# Altium schematic sheet 01_MAIN.SchDoc: =GlobalProjectName
size 594 x 420 mm; CheckedBy: A_D; Author: A_D; SheetNumber: 1; SheetTotal: 3; PageSetup: Record=PageOptions|CenterHorizontal=True|CenterVertical=True|PrintScale=0.70|XCorrection=1.00|YCorrection=1.00|PrintKind=2|BorderSize=5000000|LeftOffset=9000|BottomOffset=10100|Orientation=2|PaperLength=11176|PaperWidth=8636|Scale=100|PaperSource=259|PrintQuality=-3|MediaType=1|DitherType=10|PrintScaleMode=1|PaperKind=A3|PaperIndex=8
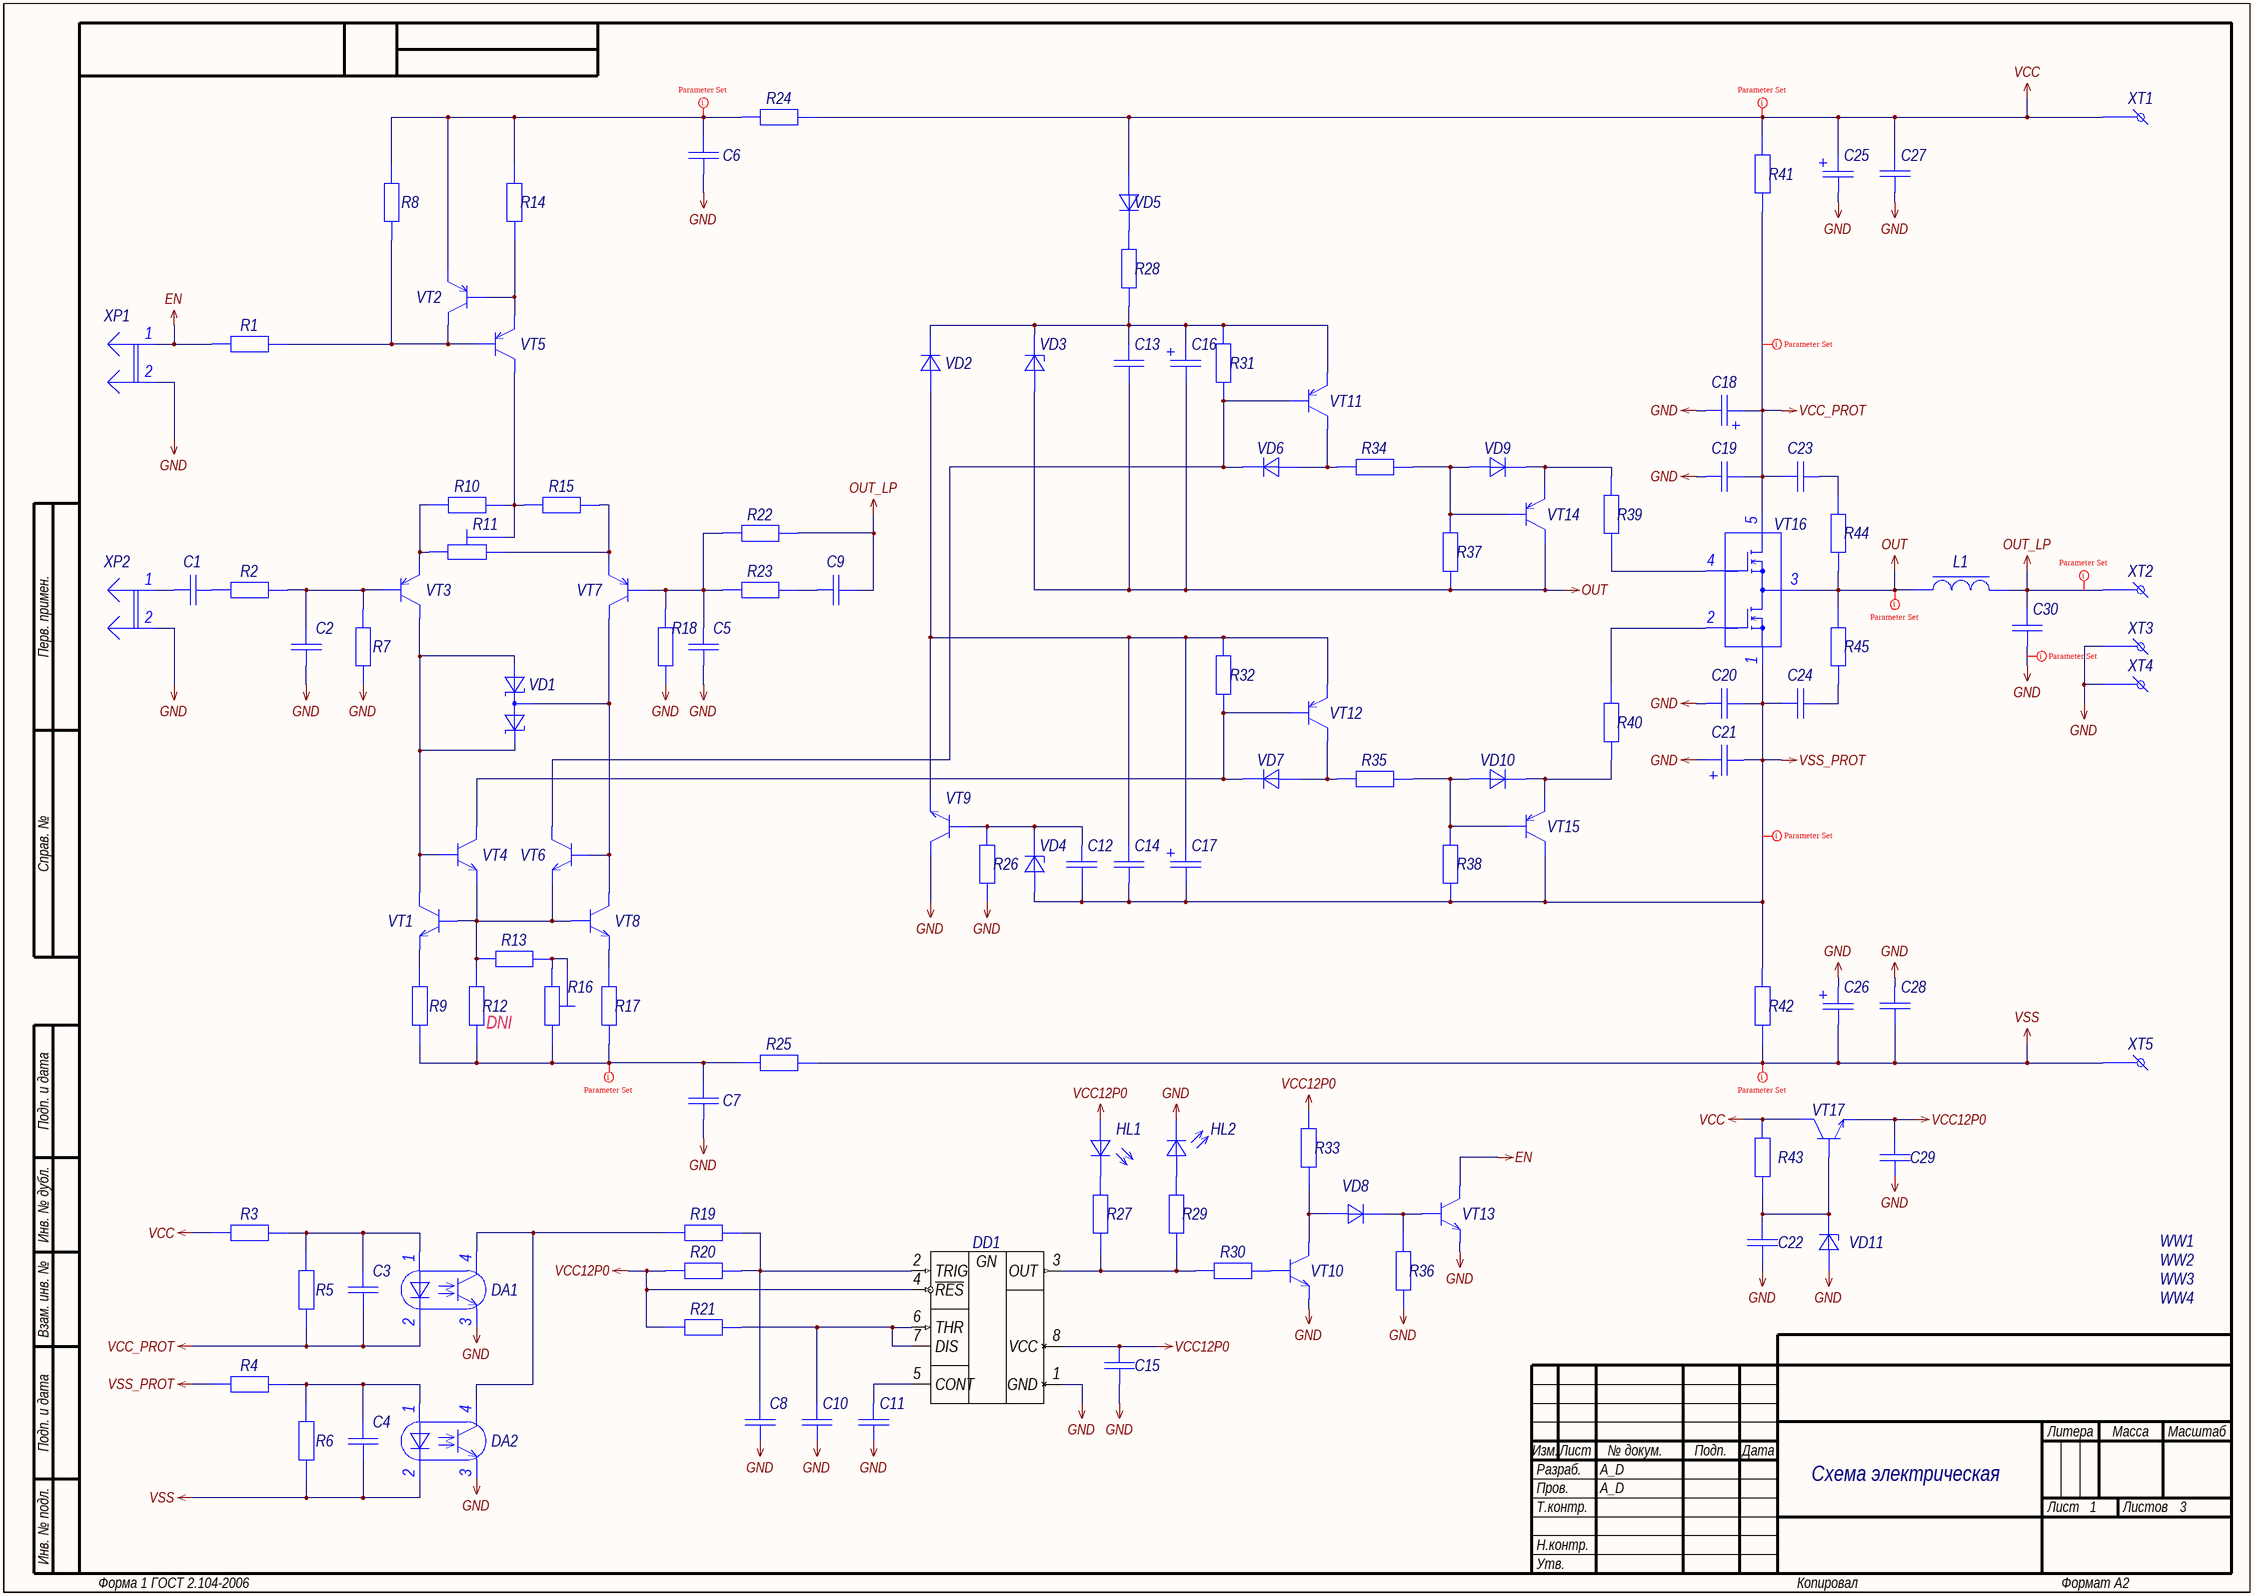
[diagram p0: 01_MAIN.SchDoc]

## Parts
C1  Capacitor  [CAPF_050D500P720X500X1000]  (value not drawn)
C2  Capacitor  [CAPF_050D500P720X450X600]  (value not drawn)
C3  Capacitor  [C0603_L]  (value not drawn)
C4  Capacitor  [C0603_L]  (value not drawn)
C5  Capacitor  [C0603_L]  (value not drawn)
C6  Capacitor  [C0805_L]  (value not drawn)
C7  Capacitor  [C0805_L]  (value not drawn)
C8  Capacitor  [C0603_L]  (value not drawn)
C9  Capacitor  [C0603_L]  (value not drawn)
C10  Capacitor  [C0603_L]  (value not drawn)
C11  Capacitor  [C0603_L]  (value not drawn)
C12  Capacitor  [C0603_L]  (value not drawn)
C13  Capacitor  [C0805_L]  (value not drawn)
C14  Capacitor  [C0805_L]  (value not drawn)
C15  Capacitor  [C0603_L]  (value not drawn)
C16  Capacitor-E  [CAPE_040D250P630X1100]  (value not drawn)
C17  Capacitor-E  [CAPE_040D250P630X1100]  (value not drawn)
C18  Capacitor-E  [CAPE_040D200P500X1100]  (value not drawn)
C19  Capacitor  [C0805_L]  (value not drawn)
C20  Capacitor  [C0805_L]  (value not drawn)
C21  Capacitor-E  [CAPE_040D200P500X1100]  (value not drawn)
C22  Capacitor  [C0603_L]  (value not drawn)
C23  Capacitor  [C0603_L]  (value not drawn)
C24  Capacitor  [C0603_L]  (value not drawn)
C25  Capacitor-E  [CAPE_060D500P1000X2000]  (value not drawn)
C26  Capacitor-E  [CAPE_060D500P1000X2000]  (value not drawn)
C27  Capacitor  [C0805_L]  (value not drawn)
C28  Capacitor  [C0805_L]  (value not drawn)
C29  Capacitor  [C0805_L]  (value not drawn)
C30  Capacitor  [CAPF_080D1500P1800X600X1250]  (value not drawn)
DA1  Photocoupler-4p  [SOP-4_254P430X440X200_N]  (value not drawn)
DA2  Photocoupler-4p  [SOP-4_254P430X440X200_N]  (value not drawn)
DD1  TIM-555  [SOIC-8_127P490X391X155_N]  (value not drawn)
HL1  ON  [LD0603]  (value not drawn)
HL2  PROT  [LD0603]  (value not drawn)
L1  Coil  [B82477G4-Series]  (value not drawn)
R1  Resistor  [R0603_L]  (value not drawn)
R2  Resistor  [R0603_L]  (value not drawn)
R3  Resistor  [R0603_L]  (value not drawn)
R4  Resistor  [R0603_L]  (value not drawn)
R5  Resistor  [R0603_L]  (value not drawn)
R6  Resistor  [R0603_L]  (value not drawn)
R7  Resistor  [R0603_L]  (value not drawn)
R8  Resistor  [R0603_L]  (value not drawn)
R9  Resistor  [R0603_L]  (value not drawn)
R10  Resistor  [R0603_L]  (value not drawn)
R11  Resistor-Trimmer-1  [3266W]  (value not drawn)
R12  Resistor  [R0603_L]  (value not drawn)  (no BOM)
R13  Resistor  [R0603_L]  (value not drawn)
R14  Resistor  [R0603_L]  (value not drawn)
R15  Resistor  [R0603_L]  (value not drawn)
R16  Resistor-Trimmer-1  [3266W]  (value not drawn)
R17  Resistor  [R0603_L]  (value not drawn)
R18  Resistor  [R0603_L]  (value not drawn)
R19  Resistor  [R0603_L]  (value not drawn)
R20  Resistor  [R0603_L]  (value not drawn)
R21  Resistor  [R0603_L]  (value not drawn)
R22  Resistor  [R0603_L]  (value not drawn)
R23  Resistor  [R0603_L]  (value not drawn)
R24  Resistor  [R0805_L]  (value not drawn)
R25  Resistor  [R0805_L]  (value not drawn)
R26  Resistor  [R0603_L]  (value not drawn)
R27  Resistor  [R0603_L]  (value not drawn)
R28  Resistor  [R0603_L]  (value not drawn)
R29  Resistor  [R0603_L]  (value not drawn)
R30  Resistor  [R0603_L]  (value not drawn)
R31  Resistor  [R0603_L]  (value not drawn)
R32  Resistor  [R0603_L]  (value not drawn)
R33  Resistor  [R0603_L]  (value not drawn)
R34  Resistor  [R0603_L]  (value not drawn)
R35  Resistor  [R0603_L]  (value not drawn)
R36  Resistor  [R0603_L]  (value not drawn)
R37  Resistor  [R0603_L]  (value not drawn)
R38  Resistor  [R0603_L]  (value not drawn)
R39  Resistor  [R0603_L]  (value not drawn)
R40  Resistor  [R0603_L]  (value not drawn)
R41  Resistor  [R2512_L]  (value not drawn)
R42  Resistor  [R2512_L]  (value not drawn)
R43  Resistor  [R0603_L]  (value not drawn)
R44  Resistor  [R0805_L]  (value not drawn)
R45  Resistor  [R0805_L]  (value not drawn)
VD1  Schottky_AC  [SOT-23_190P290X160X145_N]  (value not drawn)
VD2  Diode  [SOD-323]  (value not drawn)
VD3  Zener  [SOD-323]  (value not drawn)
VD4  Zener  [SOD-323]  (value not drawn)
VD5  Diode  [SOD-323]  (value not drawn)
VD6  Diode  [SOD-323]  (value not drawn)
VD7  Diode  [SOD-323]  (value not drawn)
VD8  Diode  [SOD-323]  (value not drawn)
VD9  Diode  [SOD-323]  (value not drawn)
VD10  Diode  [SOD-323]  (value not drawn)
VD11  Zener  [SOD-323]  (value not drawn)
VT1  BJT-NPN  [SOT-23_190P290X160X145_N]  (value not drawn)
VT2  BJT-PNP  [SOT-23_190P290X160X145_N]  (value not drawn)
VT3  BJT-PNP  [SOT-23_190P290X160X145_N]  (value not drawn)
VT4  BJT-NPN  [SOT-23_190P290X160X145_N]  (value not drawn)
VT5  BJT-PNP  [SOT-89_150P460X260X170_N]  (value not drawn)
VT6  BJT-NPN  [SOT-23_190P290X160X145_N]  (value not drawn)
VT7  BJT-PNP  [SOT-23_190P290X160X145_N]  (value not drawn)
VT8  BJT-NPN  [SOT-23_190P290X160X145_N]  (value not drawn)
VT9  BJT-NPN  [SOT-89_150P460X260X170_N]  (value not drawn)
VT10  BJT-NPN  [SOT-23_190P290X160X145_N]  (value not drawn)
VT11  BJT-PNP  [SOT-23_190P290X160X145_N]  (value not drawn)
VT12  BJT-PNP  [SOT-23_190P290X160X145_N]  (value not drawn)
VT13  BJT-NPN  [SOT-23_190P290X160X145_N]  (value not drawn)
VT14  BJT-PNP  [SOT-23_190P290X160X145_N]  (value not drawn)
VT15  BJT-PNP  [SOT-23_190P290X160X145_N]  (value not drawn)
VT16  IRFI4212H-117P  [TO-220-5-117-WB]  (value not drawn)
VT17  BJT-NPN  [SOT-89_150P460X260X170_N]  (value not drawn)
WW1  NoBody  [MH_M3.0]  (value not drawn)  (no BOM)
WW2  NoBody  [MH_M3.0]  (value not drawn)  (no BOM)
WW3  NoBody  [MH_M3.0]  (value not drawn)  (no BOM)
WW4  NoBody  [MH_M3.0]  (value not drawn)  (no BOM)
XP1  EN  [PLS-2]  (value not drawn)
XP2  IN  [PLS-2]  (value not drawn)
XT1  VCC  [62650-1]  (value not drawn)
XT2  OUT  [62650-1]  (value not drawn)
XT3  GND  [62650-1]  (value not drawn)
XT4  GND  [62650-1]  (value not drawn)
XT5  VSS  [62650-1]  (value not drawn)

## Nets
EN: R1.2 VT13.2(К) XP1.1
GND: C2.1 C5.1 C6.1 C7.1 C8.1 C10.1 C11.1 C15.1 C18.2 C19.2 C20.2 C21.1 C22.1 C25.2 C26.1 C27.2 C28.1 C29.1 C30.1 DA1.3(Э) DA2.3(Э) DD1.1(GND) HL2.2(К) R7.1 R18.1 R26.1 R36.1 VD11.1(А) VT9.2(К) VT10.3(Э) VT13.3(Э) XP1.2 XP2.2 XT3.1 XT4.1
OUT: C13.1 C16.2 L1.1 R37.1 R44.1 R45.2 VD3.1(А) VT14.2(К) VT16.3(S1D2)
OUT_LP: C9.2 C30.2 L1.2 R22.2 XT2.1
VCC: C25.1 C27.1 R3.1 R24.2 R41.2 R43.2 VD5.1(А) VT17.2(К) XT1.1
VCC12P0: C15.2 C29.2 DD1.4(~{RES}) DD1.8(VCC) HL1.1(А) R20.1 R21.1 R33.2 VT17.3(Э)
VCC_PROT: C3.1 C18.1 C19.1 C23.1 DA1.2(CК) R5.1 R41.1 VT16.5(D1)
VSS: C4.1 C26.2 C28.2 DA2.2(CК) R6.1 R25.2 R42.1 XT5.1
VSS_PROT: C12.1 C14.1 C17.2 C20.1 C21.2 C24.1 R4.1 R38.1 R42.2 VD4.1(А) VT15.2(К) VT16.1(S2)
NetC1_1: C1.1 XP2.1
NetC1_2: C1.2 R2.1
NetC2_2: C2.2 R2.2 R7.2 VT3.1(Б)
NetC3_2: C3.2 DA1.1(CА) R3.2 R5.2
NetC4_2: C4.2 DA2.1(CА) R4.2 R6.2
NetC5_2: C5.2 R18.2 R22.1 R23.1 VT7.1(Б)
NetC6_2: C6.2 R8.2 R14.2 R24.1 VT2.3(Э)
NetC7_2: C7.2 R9.1 R12.1 R16.3 R17.1 R25.1
NetC8_2: C8.2 DD1.2(TRIG) R19.2 R20.2
NetC9_1: C9.1 R23.2
NetC10_2: C10.2 DD1.6(THR) DD1.7(DIS) R21.2
NetC11_2: C11.2 DD1.5(CONT)
NetC12_2: C12.2 R26.2 VD4.2(К) VT9.1(Б)
NetC13_2: C13.2 C16.1 R28.1 R31.2 VD2.2(К) VD3.2(К) VT11.3(Э)
NetC14_2: C14.2 C17.1 R32.2 VD2.1(А) VT9.3(Э) VT12.3(Э)
NetC22_2: C22.2 R43.1 VD11.2(К) VT17.1(Б)
NetC23_2: C23.2 R44.2
NetC24_2: C24.2 R45.1
NetDA1_4: DA1.4(К) DA2.4(К) R19.1
NetDD1_3: DD1.3(OUT) R27.1 R29.1 R30.1
NetHL1_2: HL1.2(К) R27.2
NetHL2_1: HL2.1(А) R29.2
NetR1_1: R1.1 R8.1 VT2.2(К) VT5.1(Б)
NetR9_2: R9.2 VT1.3(Э)
NetR10_1: R10.1 R11.3 VT3.3(Э)
NetR10_2: R10.2 R11.2 R15.1 VT5.2(К)
NetR11_1: R11.1 R15.2 VT7.3(Э)
NetR12_2: R12.2 R13.1 VT1.1(Б) VT4.3(Э) VT6.3(Э) VT8.1(Б)
NetR13_2: R13.2 R16.1 R16.2
NetR14_1: R14.1 VT2.1(Б) VT5.3(Э)
NetR17_2: R17.2 VT8.3(Э)
NetR28_2: R28.2 VD5.2(К)
NetR30_2: R30.2 VT10.1(Б)
NetR31_1: R31.1 VD6.2(К) VT6.2(К) VT11.1(Б)
NetR32_1: R32.1 VD7.2(К) VT4.2(К) VT12.1(Б)
NetR33_1: R33.1 VD8.1(А) VT10.2(К)
NetR34_1: R34.1 VD6.1(А) VT11.2(К)
NetR34_2: R34.2 R37.2 VD9.1(А) VT14.1(Б)
NetR35_1: R35.1 VD7.1(А) VT12.2(К)
NetR35_2: R35.2 R38.2 VD10.1(А) VT15.1(Б)
NetR36_2: R36.2 VD8.2(К) VT13.1(Б)
NetR39_1: R39.1 VD9.2(К) VT14.3(Э)
NetR39_2: R39.2 VT16.4(G1)
NetR40_1: R40.1 VD10.2(К) VT15.3(Э)
NetR40_2: R40.2 VT16.2(G2)
NetVD1_1: VD1.1(А1) VD1.3(C) VT1.2(К) VT3.2(К) VT4.1(Б)
NetVD1_2: VD1.2(AC) VT6.1(Б) VT7.2(К) VT8.2(К)

## Layout directives
rule Polygon Connect Style [Style - Direct Connect]; rule Clearance Constraint [Generic clearance = 0.25mm, and 9 value(s) for objects]: OUT_LP, VCC, VCC_PROT, VSS, VSS_PROT
rule Polygon Connect Style [Style - Direct Connect]: GND
rule Clearance Constraint [Generic clearance = 0.25mm, and 9 value(s) for objects]: NetC6_2, NetC7_2, OUT

## Notes on the sheet
- (near R12) DNI
- Схема электрическая
  принципиальная
- Перв. примен.
- Справ. №
- Подп. и дата
- Инв. № дубл.
- Взам. инв. №
- Разраб.
- Изм.
- Лист
- № докум.
- Подп.
- Дата
- Литера
- Масса
- Масштаб
- Пров.
- Т.контр.
- Листов
- Инв. № подл.
- Н.контр.
- Утв.
- Форма 1 ГОСТ 2.104-2006
- Копировал
- Формат А2
- (in symbol NE555D) GN

## Library data of the parts
C1 = MKS2B042201F00JSSD: Manufacturer: WIMA; Type: Конденсатор; ID: 1; Value: 2.2uF; Voltage: 50V; Tolerance: ±5%; Dielectric Type: PET Film; Working Temperature Min: -55°С; Working Temperature Max: +100°С; Published: 18.05.2010; Publisher: Andrew Danich; Part Number: MKS2B042201F00JSSD; Footprint: 5mm; Application Category: 1
C2 = FKP2D001001D00JSSD: Manufacturer: WIMA; Type: Конденсатор; ID: 3; Value: 100pF; Voltage: 100V; Tolerance: ±5%; Dielectric Type: PET Film; Application Category: 1; Working Temperature Min: -55°С; Working Temperature Max: +100°С; Published: 18.05.2010; Publisher: Andrew Danich; Part Number: FKP2D001001D00JSSD; Footprint: 5mm
C3 C4 = GRM188R71H182JA01D: Manufacturer: Murata; Type: Конденсатор; ID: 208; Value: 1800pF; Voltage: 50V; Tolerance: ±5%; Dielectric Type: X7R; Application Category: 1; Working Temperature Min: -55°С; Working Temperature Max: +125°С; Published: 18.05.2010; Publisher: Andrew Danich; Part Number: GRM188R71H182JA01D; Footprint: 0603
C5 C9 = GRM1885C1H220JA01D: Manufacturer: Murata; Type: Конденсатор; ID: 122; Value: 22pF; Voltage: 50V; Tolerance: ±5%; Dielectric Type: NP0; Application Category: 1; Working Temperature Min: -55°С; Working Temperature Max: +125°С; Published: 18.05.2010; Publisher: Andrew Danich; Part Number: GRM1885C1H220JA01D; Footprint: 0603
C6 C7 C13 C14 C19 C20 C27 C28 = GCJ21BR72A104KA01L: Manufacturer: Murata; Type: Конденсатор; ID: 138; Value: 0.1uF; Voltage: 100V; Tolerance: ±10%; Dielectric Type: X7R; Application Category: 1; Working Temperature Min: -55°С; Working Temperature Max: +125°С; Published: 18.05.2010; Publisher: Andrew Danich; Part Number: GCJ21BR72A104KA01L; Footprint: 0805
  C19 C20: ClassName: DirectConnect
C8 C15 = GCJ188R71C474KA12D: Manufacturer: Murata; Type: Конденсатор; ID: 133; Value: 0.47uF; Voltage: 16V; Tolerance: ±10%; Dielectric Type: X7R; Application Category: 1; Working Temperature Min: -55°С; Working Temperature Max: +125°С; Published: 18.05.2010; Publisher: Andrew Danich; Part Number: GCJ188R71C474KA12D; Footprint: 0603
C10-C12 C22 = GCM188R71E105KA64D: Manufacturer: Murata; Type: Конденсатор; ID: 134; Value: 1uF; Voltage: 25V; Tolerance: ±10%; Dielectric Type: X7R; Application Category: 1; Working Temperature Min: -55°С; Working Temperature Max: +85°С; Published: 18.05.2010; Publisher: Andrew Danich; Part Number: GCM188R71E105KA64D; Footprint: 0603
C16 C17 = TKR101M1VE11: Manufacturer: Jamicon; Type: Конденсатор; ID: 2; Value: 100uF; Voltage: 35V; Tolerance: ±20%; Application Category: 1; Working Temperature Min: -55°С; Working Temperature Max: +105°С; Published: 20.08.2010; Publisher: Andrew Danich; Part Number: TKR101M1VE11; Footprint: 6.3x11mm
C18 C21 = TKR220M1JD11: Manufacturer: Jamicon; Type: Конденсатор; ID: 4; Value: 22uF; Voltage: 63V; Tolerance: ±20%; Application Category: 1; Working Temperature Min: -55°С; Working Temperature Max: +105°С; Published: 20.08.2010; Publisher: Andrew Danich; Part Number: TKR220M1JD11; Footprint: 5x11mm; ClassName: DirectConnect
C23 C24 = GCM1885C2A101JA16D: Manufacturer: Murata; Type: Конденсатор; ID: 155; Value: 100pF; Voltage: 100V; Tolerance: ±5%; Dielectric Type: NP0; Application Category: 1; Working Temperature Min: -55°С; Working Temperature Max: +125°С; Published: 18.05.2010; Publisher: Andrew Danich; Part Number: GCM1885C2A101JA16D; Footprint: 0603
C25 C26 = TKR471M1HG20: Manufacturer: Jamicon; Type: Конденсатор; ID: 3; Value: 470uF; Voltage: 50V; Tolerance: ±20%; Application Category: 1; Working Temperature Min: -55°С; Working Temperature Max: +105°С; Published: 20.08.2010; Publisher: Andrew Danich; Part Number: TKR471M1HG20; Footprint: 10x20mm; ClassName: DirectConnect
C29 = GRM21BR61E106KA73L: Manufacturer: Murata; Type: Конденсатор; ID: 53; Value: 10uF; Voltage: 25V; Tolerance: ±10%; Dielectric Type: X5R; Application Category: 1; Published: 18.05.2010; Publisher: Andrew Danich; Part Number: GRM21BR61E106KA73L; Footprint: 0805
C30 = MKS4D036804C00KSP1: Manufacturer: WIMA; Type: Конденсатор; ID: 4; Value: 0.68uF; Voltage: 100V; Tolerance: ±5%; Dielectric Type: PET Film; Application Category: 1; Working Temperature Min: -55°С; Working Temperature Max: +100°С; Published: 18.05.2010; Publisher: Andrew Danich; Part Number: MKS4D036804C00KSP1; Footprint: 15mm; ClassName: DirectConnect
DA1 DA2 = SFH690CT: Manufacturer: Vishay Semiconductors; ID: 8; Input Voltage: 1.4V; Input Current: 50mA; Output Voltage: 70V; Total Power Dissipation: 150mW; Current Transfer Ratio: 100…200%; Application Category: 1; Working Temperature Min: -55°С; Working Temperature Max: +100°С; Published: 09.01.2017; Publisher: Andrew Danich; Type: Микросхема; Part Number: SFH690CT; Value: SFH690CT; Output Current: 50mA
DD1 = NE555D: Part Number: NE555D; Manufacturer: Texas Instruments; ID: 2; Value: NE555D; Supply Operation: +4.5…16V; Supply Current: 15mA; Output Current: 200mA; № of Elements: 1; Series Type: Timer 555; Functional Analog: SA555D, SE555D; Published: 07.08.2015; Publisher: Andrew Danich; Type: Микросхема; Application Category: 1
HL1 = BL-LS0603GC: Type: Индикатор единичный; ID: 14; Forward Voltage: 2.3V; Forward Current: 30mA; Power Dissipation: 65mW; Color: Green; Leds: 1; Published: 03.12.2013; Publisher: Andrew Danich; Part Number: BL-LS0603GC; Value: BL-LS0603GC; Footprint: 0603; Application Category: 1
HL2 = BL-LS0603EC: Type: Индикатор единичный; ID: 15; Forward Voltage: 2.1V; Forward Current: 30mA; Power Dissipation: 65mW; Color: Orange; Leds: 1; Published: 03.12.2013; Publisher: Andrew Danich; Part Number: BL-LS0603EC; Value: BL-LS0603EC; Footprint: 0603; Application Category: 1
L1 = B82477G4103M000: Manufacturer: Epcos; Type: Дроссель; ID: 27; Rated Current: 5.4A; Tolerance: ±20%; Inductance: 10uH; DC Resistance: 0.022ohm; Application Category: 1; Working Temperature Min: -55°С; Working Temperature Max: +125°С; Published: 20.05.2010; Publisher: Andrew Danich; Part Number: B82477G4103M000; Value: B82477G4103M000; ClassName: DirectConnect
R1 R8 = RC0603JR-0747KL: Manufacturer: Yageo; ID: 63; Value: 47k; Limit Voltage: 50V; Tolerance: ±5%; Temperature Coefficient: 100ppm; Total Power Dissipation: 0.1W; Series Type: Thick-Film; Application Category: 1; Working Temperature Min: -55°С; Working Temperature Max: +155°С; Published: 24.03.2010; Publisher: Andrew Danich; Type: Резистор; Part Number: RC0603JR-0747KL; Footprint: 0603
R2 R23 = RC0603JR-071KL: Manufacturer: Yageo; ID: 19; Value: 1k; Limit Voltage: 50V; Tolerance: ±5%; Temperature Coefficient: 100ppm; Total Power Dissipation: 0.1W; Series Type: Thick-Film; Application Category: 1; Working Temperature Min: -55°С; Working Temperature Max: +155°С; Functional Analog: CR0603-JW-102E; Published: 24.03.2010; Publisher: Andrew Danich; Type: Резистор; Part Number: RC0603JR-071KL; Footprint: 0603
R3 R4 R31 R32 = RC0603JR-07470R: Manufacturer: Yageo; ID: 61; Value: 470; Limit Voltage: 50V; Tolerance: ±5%; Temperature Coefficient: 100ppm; Total Power Dissipation: 0.1W; Series Type: Thick-Film; Application Category: 1; Working Temperature Min: -55°С; Working Temperature Max: +155°С; Published: 24.03.2010; Publisher: Andrew Danich; Type: Резистор; Part Number: RC0603JR-07470R; Footprint: 0603
R5 R6 R30 R36 = RC0603JR-0710KL: Manufacturer: Yageo; ID: 12; Value: 10k; Limit Voltage: 50V; Tolerance: ±5%; Temperature Coefficient: 100ppm; Total Power Dissipation: 0.1W; Series Type: Thick-Film; Application Category: 1; Working Temperature Min: -55°С; Working Temperature Max: +155°С; Functional Analog: CR0603-JW-103E; Published: 24.03.2010; Publisher: Andrew Danich; Type: Резистор; Part Number: RC0603JR-0710KL; Footprint: 0603
R7 R18 = RC0603JR-071K5L: Manufacturer: Yageo; ID: 8; Value: 1.5k; Limit Voltage: 50V; Tolerance: ±5%; Temperature Coefficient: 100ppm; Total Power Dissipation: 0.1W; Series Type: Thick-Film; Application Category: 1; Working Temperature Min: -55°С; Working Temperature Max: +155°С; Published: 24.03.2010; Publisher: Andrew Danich; Type: Резистор; Part Number: RC0603JR-071K5L; Footprint: 0603
R9 R17 = RC0603JR-0751RL: Manufacturer: Yageo; ID: 314; Value: 51; Limit Voltage: 50V; Tolerance: ±5%; Temperature Coefficient: 100ppm; Total Power Dissipation: 0.1W; Series Type: Thick-Film; Application Category: 1; Working Temperature Min: -55°С; Working Temperature Max: +155°С; Functional Analog: CR0603-JW-510E; Published: 24.03.2010; Publisher: Andrew Danich; Type: Резистор; Part Number: RC0603JR-0751RL; Footprint: 0603
R10 R15 = RC0603JR-0747RL: Manufacturer: Yageo; ID: 60; Value: 47; Limit Voltage: 50V; Tolerance: ±5%; Temperature Coefficient: 100ppm; Total Power Dissipation: 0.1W; Series Type: Thick-Film; Application Category: 1; Working Temperature Min: -55°С; Working Temperature Max: +155°С; Published: 24.03.2010; Publisher: Andrew Danich; Type: Резистор; Part Number: RC0603JR-0747RL; Footprint: 0603
R11 = 3266W-1-501: Manufacturer: Bourns; ID: 5; Value: 500; Limit Voltage: 250V; Tolerance: ±10%; Temperature Coefficient: 100ppm; Total Power Dissipation: 0.25W; Channel: 1; Working Temperature Min: -55°С; Working Temperature Max: +125°С; Functional Analog: 3266X-1-501LF; Publisher: Andrew Danich; Type: Подстроечный резистор; Published: 27.07.2015; Part Number: 3266W-1-501; Taper Type: Linear; Application Category: 1
R12 = RC0603JR-07330RL: Manufacturer: Yageo; ID: 313; Value: 330; Limit Voltage: 50V; Tolerance: ±5%; Temperature Coefficient: 100ppm; Total Power Dissipation: 0.1W; Series Type: Thick-Film; Application Category: 1; Working Temperature Min: -55°С; Working Temperature Max: +155°С; Functional Analog: CR0603-JW-331E; Published: 24.03.2010; Publisher: Andrew Danich; Type: Резистор; Part Number: RC0603JR-07330RL; Footprint: 0603
R13 = RC0603JR-07100R: Manufacturer: Yageo; ID: 10; Value: 100; Limit Voltage: 50V; Tolerance: ±5%; Temperature Coefficient: 100ppm; Total Power Dissipation: 0.1W; Series Type: Thick-Film; Application Category: 1; Working Temperature Min: -55°С; Working Temperature Max: +155°С; Functional Analog: CR0603-JW-101E; Published: 24.03.2010; Publisher: Andrew Danich; Type: Резистор; Part Number: RC0603JR-07100R; Footprint: 0603
R14 = RC0603JR-07220R: Manufacturer: Yageo; ID: 30; Value: 220; Limit Voltage: 50V; Tolerance: ±5%; Temperature Coefficient: 100ppm; Total Power Dissipation: 0.1W; Series Type: Thick-Film; Application Category: 1; Working Temperature Min: -55°С; Working Temperature Max: +155°С; Published: 24.03.2010; Publisher: Andrew Danich; Type: Резистор; Part Number: RC0603JR-07220R; Footprint: 0603
R16 = 3266W-1-502: Manufacturer: Bourns; ID: 6; Value: 5k; Limit Voltage: 250V; Tolerance: ±10%; Temperature Coefficient: 100ppm; Total Power Dissipation: 0.25W; Channel: 1; Working Temperature Min: -55°С; Working Temperature Max: +125°С; Functional Analog: 3266X-1-501LF; Publisher: Andrew Danich; Type: Подстроечный резистор; Published: 27.07.2015; Part Number: 3266W-1-502; Taper Type: Linear; Application Category: 1
R19 = RC0603JR-0710RL: Manufacturer: Yageo; ID: 9; Value: 10; Limit Voltage: 50V; Tolerance: ±5%; Temperature Coefficient: 100ppm; Total Power Dissipation: 0.1W; Series Type: Thick-Film; Application Category: 1; Working Temperature Min: -55°С; Working Temperature Max: +155°С; Functional Analog: CR0603-JW-100E; Published: 24.03.2010; Publisher: Andrew Danich; Type: Резистор; Part Number: RC0603JR-0710RL; Footprint: 0603
R20 R21 = RC0603JR-071ML: Manufacturer: Yageo; ID: 20; Value: 1meg; Limit Voltage: 50V; Tolerance: ±5%; Temperature Coefficient: 100ppm; Total Power Dissipation: 0.1W; Series Type: Thick-Film; Application Category: 1; Working Temperature Min: -55°С; Working Temperature Max: +155°С; Published: 24.03.2010; Publisher: Andrew Danich; Type: Резистор; Part Number: RC0603JR-071ML; Footprint: 0603
R22 R26 R43 = RC0603JR-078K2L: Manufacturer: Yageo; ID: 82; Value: 8.2k; Limit Voltage: 50V; Tolerance: ±5%; Temperature Coefficient: 100ppm; Total Power Dissipation: 0.1W; Series Type: Thick-Film; Application Category: 1; Working Temperature Min: -55°С; Working Temperature Max: +155°С; Published: 24.03.2010; Publisher: Andrew Danich; Type: Резистор; Part Number: RC0603JR-078K2L; Footprint: 0603
R24 R25 R44 R45 = RC0805JR-0710RL: Manufacturer: Yageo; ID: 96; Value: 10; Limit Voltage: 150V; Tolerance: ±5%; Temperature Coefficient: 100ppm; Total Power Dissipation: 0.125W; Series Type: Thick-Film; Application Category: 1; Working Temperature Min: -55°С; Working Temperature Max: +155°С; Published: 24.03.2010; Publisher: Andrew Danich; Type: Резистор; Part Number: RC0805JR-0710RL; Footprint: 0805
R27 R29 = RC0603JR-072K2L: Manufacturer: Yageo; ID: 22; Value: 2.2k; Limit Voltage: 50V; Tolerance: ±5%; Temperature Coefficient: 100ppm; Total Power Dissipation: 0.1W; Series Type: Thick-Film; Application Category: 1; Working Temperature Min: -55°С; Working Temperature Max: +155°С; Published: 24.03.2010; Publisher: Andrew Danich; Type: Резистор; Part Number: RC0603JR-072K2L; Footprint: 0603
R28 = RC0603JR-074K7L: Manufacturer: Yageo; ID: 56; Value: 4.7k; Limit Voltage: 50V; Tolerance: ±5%; Temperature Coefficient: 100ppm; Total Power Dissipation: 0.1W; Series Type: Thick-Film; Application Category: 1; Working Temperature Min: -55°С; Working Temperature Max: +155°С; Published: 24.03.2010; Publisher: Andrew Danich; Type: Резистор; Part Number: RC0603JR-074K7L; Footprint: 0603
R33 = RC0603JR-0722KL: Manufacturer: Yageo; ID: 32; Value: 22k; Limit Voltage: 50V; Tolerance: ±5%; Temperature Coefficient: 100ppm; Total Power Dissipation: 0.1W; Series Type: Thick-Film; Application Category: 1; Working Temperature Min: -55°С; Working Temperature Max: +155°С; Published: 24.03.2010; Publisher: Andrew Danich; Type: Резистор; Part Number: RC0603JR-0722KL; Footprint: 0603
R34 R35 = RC0603JR-0730RL: Manufacturer: Yageo; ID: 412; Value: 30; Limit Voltage: 50V; Tolerance: ±5%; Temperature Coefficient: 100ppm; Total Power Dissipation: 0.1W; Series Type: Thick-Film; Application Category: 1; Working Temperature Min: -55°С; Working Temperature Max: +155°С; Published: 24.03.2010; Publisher: Andrew Danich; Type: Резистор; Part Number: RC0603JR-0730RL; Footprint: 0603
R37 R38 = RC0603FR-07390RL: Manufacturer: Yageo; ID: 306; Value: 390; Limit Voltage: 50V; Tolerance: ±1%; Temperature Coefficient: 100ppm; Total Power Dissipation: 0.1W; Series Type: Thick-Film; Application Category: 1; Working Temperature Min: -55°С; Working Temperature Max: +155°С; Published: 24.03.2010; Publisher: Andrew Danich; Type: Резистор; Part Number: RC0603FR-07390RL; Footprint: 0603
R39 R40 = RC0603JR-070R: Manufacturer: Yageo; ID: 5; Value: 0; Limit Voltage: 50V; Tolerance: ±5%; Temperature Coefficient: 100ppm; Total Power Dissipation: 0.1W; Series Type: Thick-Film; Application Category: 1; Working Temperature Min: -55°С; Working Temperature Max: +155°С; Functional Analog: RC0603FR-070RL, CR0603-J/-000E; Published: 24.03.2010; Publisher: Andrew Danich; Type: Резистор; Part Number: RC0603JR-070R; Footprint: 0603
R41 R42 = RL2512FK-070R33L: Manufacturer: Yageo; ID: 220; Value: 0.33; Limit Voltage: 200V; Tolerance: ±1%; Temperature Coefficient: 100ppm; Total Power Dissipation: 1W; Series Type: Thick-Film; Application Category: 1; Working Temperature Min: -55°С; Working Temperature Max: +155°С; Published: 24.03.2010; Publisher: Andrew Danich; Type: Резистор; Part Number: RL2512FK-070R33L; Footprint: 2512
VD1 = BAT54S: Part Number: BAT54S; Manufacturer: NXP Semiconductors; Type: Сборка диодная; ID: 14; Value: BAT54S; Reverse Voltage: 30V; Reverse Current: 2uA; Forward Voltage: 0.5V; Forward Current: 200mA; Total Power Dissipation: 290mW; Capacitance: 10pF; Max Operating Frequency: 5nS; Application Category: 1; Working Temperature Min: -55°С; Working Temperature Max: +150°С; Published: 08.08.2014; Publisher: Andrew Danich
VD2 VD6 VD7 VD9 VD10 = BAS316: Part Number: BAS316; Manufacturer: NXP; Type: Диод; ID: 14; Value: BAS316; Reverse Voltage: 100V; Reverse Current: 0.5uA; Forward Current: 250mA; Total Power Dissipation: 400mW; Recovery Time: 4nS; Application Category: 1; Published: 18.05.2010; Publisher: Andrew Danich
VD3 VD4 VD11 = BZX384-C12: Manufacturer: NXP; Type: Стабилитрон; ID: 20; Working Voltage: 12V; Reverse Current: 0.1uA; Forward Voltage: 0.9V; Forward Current: 250mA; Total Power Dissipation: 300mW; Capacitance: 85pF; Differential resistance: 150ohm; Application Category: 1; Working Temperature Min: -65°С; Working Temperature Max: +150°С; Published: 20.05.2013; Publisher: Andrew Danich; Part Number: BZX384-C12; Value: BZX384-C12
VD5 VD8 = 1N4148WS-7-F: Manufacturer: Diodes Incorporated; Type: Диод; ID: 13; Reverse Voltage: 100V; Reverse Current: 1uA; Forward Voltage: 1V; Forward Current: 150mA; Total Power Dissipation: 200mW; Capacitance: 2pF; Recovery Time: 4nS; Application Category: 1; Working Temperature Min: -55°С; Working Temperature Max: +150°С; Published: 18.05.2010; Publisher: Andrew Danich; Part Number: 1N4148WS-7-F; Value: 1N4148WS-7-F; Functional Analog: 1N4148WS
VT1 VT8 VT10 VT13 = BC847: Part Number: BC847; Type: Транзистор; ID: 1; Value: BC847; C-E Voltage: 45V; Collector Current: 100mA; C-E Saturation Voltage: 0.6V; DC Current Gain: 110…800; Total Power Dissipation: 250mW; Transition Frequency: 100MHz; Published: 07.05.2013; Publisher: Andrew Danich; Application Category: 1
VT2 = BC857: Part Number: BC857; Type: Транзистор; ID: 2; Value: BC857; C-E Voltage: 45V; Collector Current: 100mA; C-E Saturation Voltage: 0.6V; DC Current Gain: 125…800; Total Power Dissipation: 250mW; Transition Frequency: 100MHz; Application Category: 1; Published: 07.05.2013; Publisher: Andrew Danich
VT3 VT7 = MMBT5401: Type: Транзистор; ID: 8; C-E Voltage: 160V; Collector Current: 600mA; C-E Saturation Voltage: 0.5V; DC Current Gain: 60…240; Total Power Dissipation: 350mW; Transition Frequency: 100MHz; Application Category: 1; Published: 07.05.2013; Publisher: Andrew Danich; Part Number: MMBT5401; Value: MMBT5401
VT4 VT6 = MMBT5551: Type: Транзистор; ID: 7; C-E Voltage: 160V; Collector Current: 600mA; C-E Saturation Voltage: 0.2V; DC Current Gain: 50…250; Total Power Dissipation: 350mW; Transition Frequency: 100MHz; Application Category: 1; Published: 07.05.2013; Publisher: Andrew Danich; Part Number: MMBT5551; Value: MMBT5551
VT5 = BCX53: Part Number: BCX53; Type: Транзистор; ID: 4; Value: BCX53; C-E Voltage: 80V; Collector Current: 1A; Application Category: 1; Published: 07.05.2013; Publisher: Andrew Danich
VT9 VT17 = BCX56: Part Number: BCX56; Type: Транзистор; ID: 3; Value: BCX56; C-E Voltage: 80V; Collector Current: 1A; Application Category: 1; Published: 07.05.2013; Publisher: Andrew Danich
VT11 VT12 VT14 VT15 = BC807: Part Number: BC807; Manufacturer: NXP; Type: Транзистор; ID: 15; Value: BC807; C-E Voltage: 45V; Collector Current: 500mA; C-E Saturation Voltage: 0.7V; DC Current Gain: 100…600; Total Power Dissipation: 250mW; Transition Frequency: 80MHz; Application Category: 1; Working Temperature Min: -65°С; Working Temperature Max: +150°С; Functional Analog: BC807-40; Published: 07.05.2013; Publisher: Andrew Danich
VT16 = IRFI4212H-117P: Manufacturer: Infineon; Type: Сборка транзисторная; ID: 1; D-S Voltage: 100V; Drain Current: 11A; D-S On-Resistance: 0.058omh; Gate Capacitance: 490pF; Total Power Dissipation: 18W; Thermal Resistance to Case: 7.1°C/W; Gate Threshold Voltage: 5V; Working Temperature Min: -55°C; Working Temperature Max: +150°C; Published: 14.09.2018; Publisher: Andrew Danich; Part Number: IRFI4212H-117P; Value: IRFI4212H-117P; Application Category: 1; ClassName: DirectConnect
WW1-WW4 = MOUNTINGHOLE: ID: 1; Published: 24.03.2015; Publisher: Andrew Danich; Type: Лепесток; Part Number: MOUNTINGHOLE; Value: MOUNTINGHOLE
XP1 XP2 = PLS-2: Value: PLS-2; ID: 1; Limit Voltage: 250V; Limit Current: 3A; Connector Type: Male; Resistance: 15momh; Surface Finish: Gold; Pitch: 2.54mm; Published: 07.03.2013; Publisher: Andrew Danich; Type: Вилка; Part Number: PLS-2; Pins: 2; Application Category: 1
XT1-XT5 = 62650-1: Manufacturer: TE Connectivity; ID: 20; Pitch: 5.08mm; Application Category: 1; Published: 27.07.2015; Publisher: Andrew Danich; Type: Клеммный соединитель; Part Number: 62650-1; Value: 62650-1; Pins: 2; ClassName: DirectConnect